# Altium schematic sheet 00-Chopper-AB.SchDoc
size C; DocumentNumber: 1; SheetNumber: 1; SheetTotal: 4
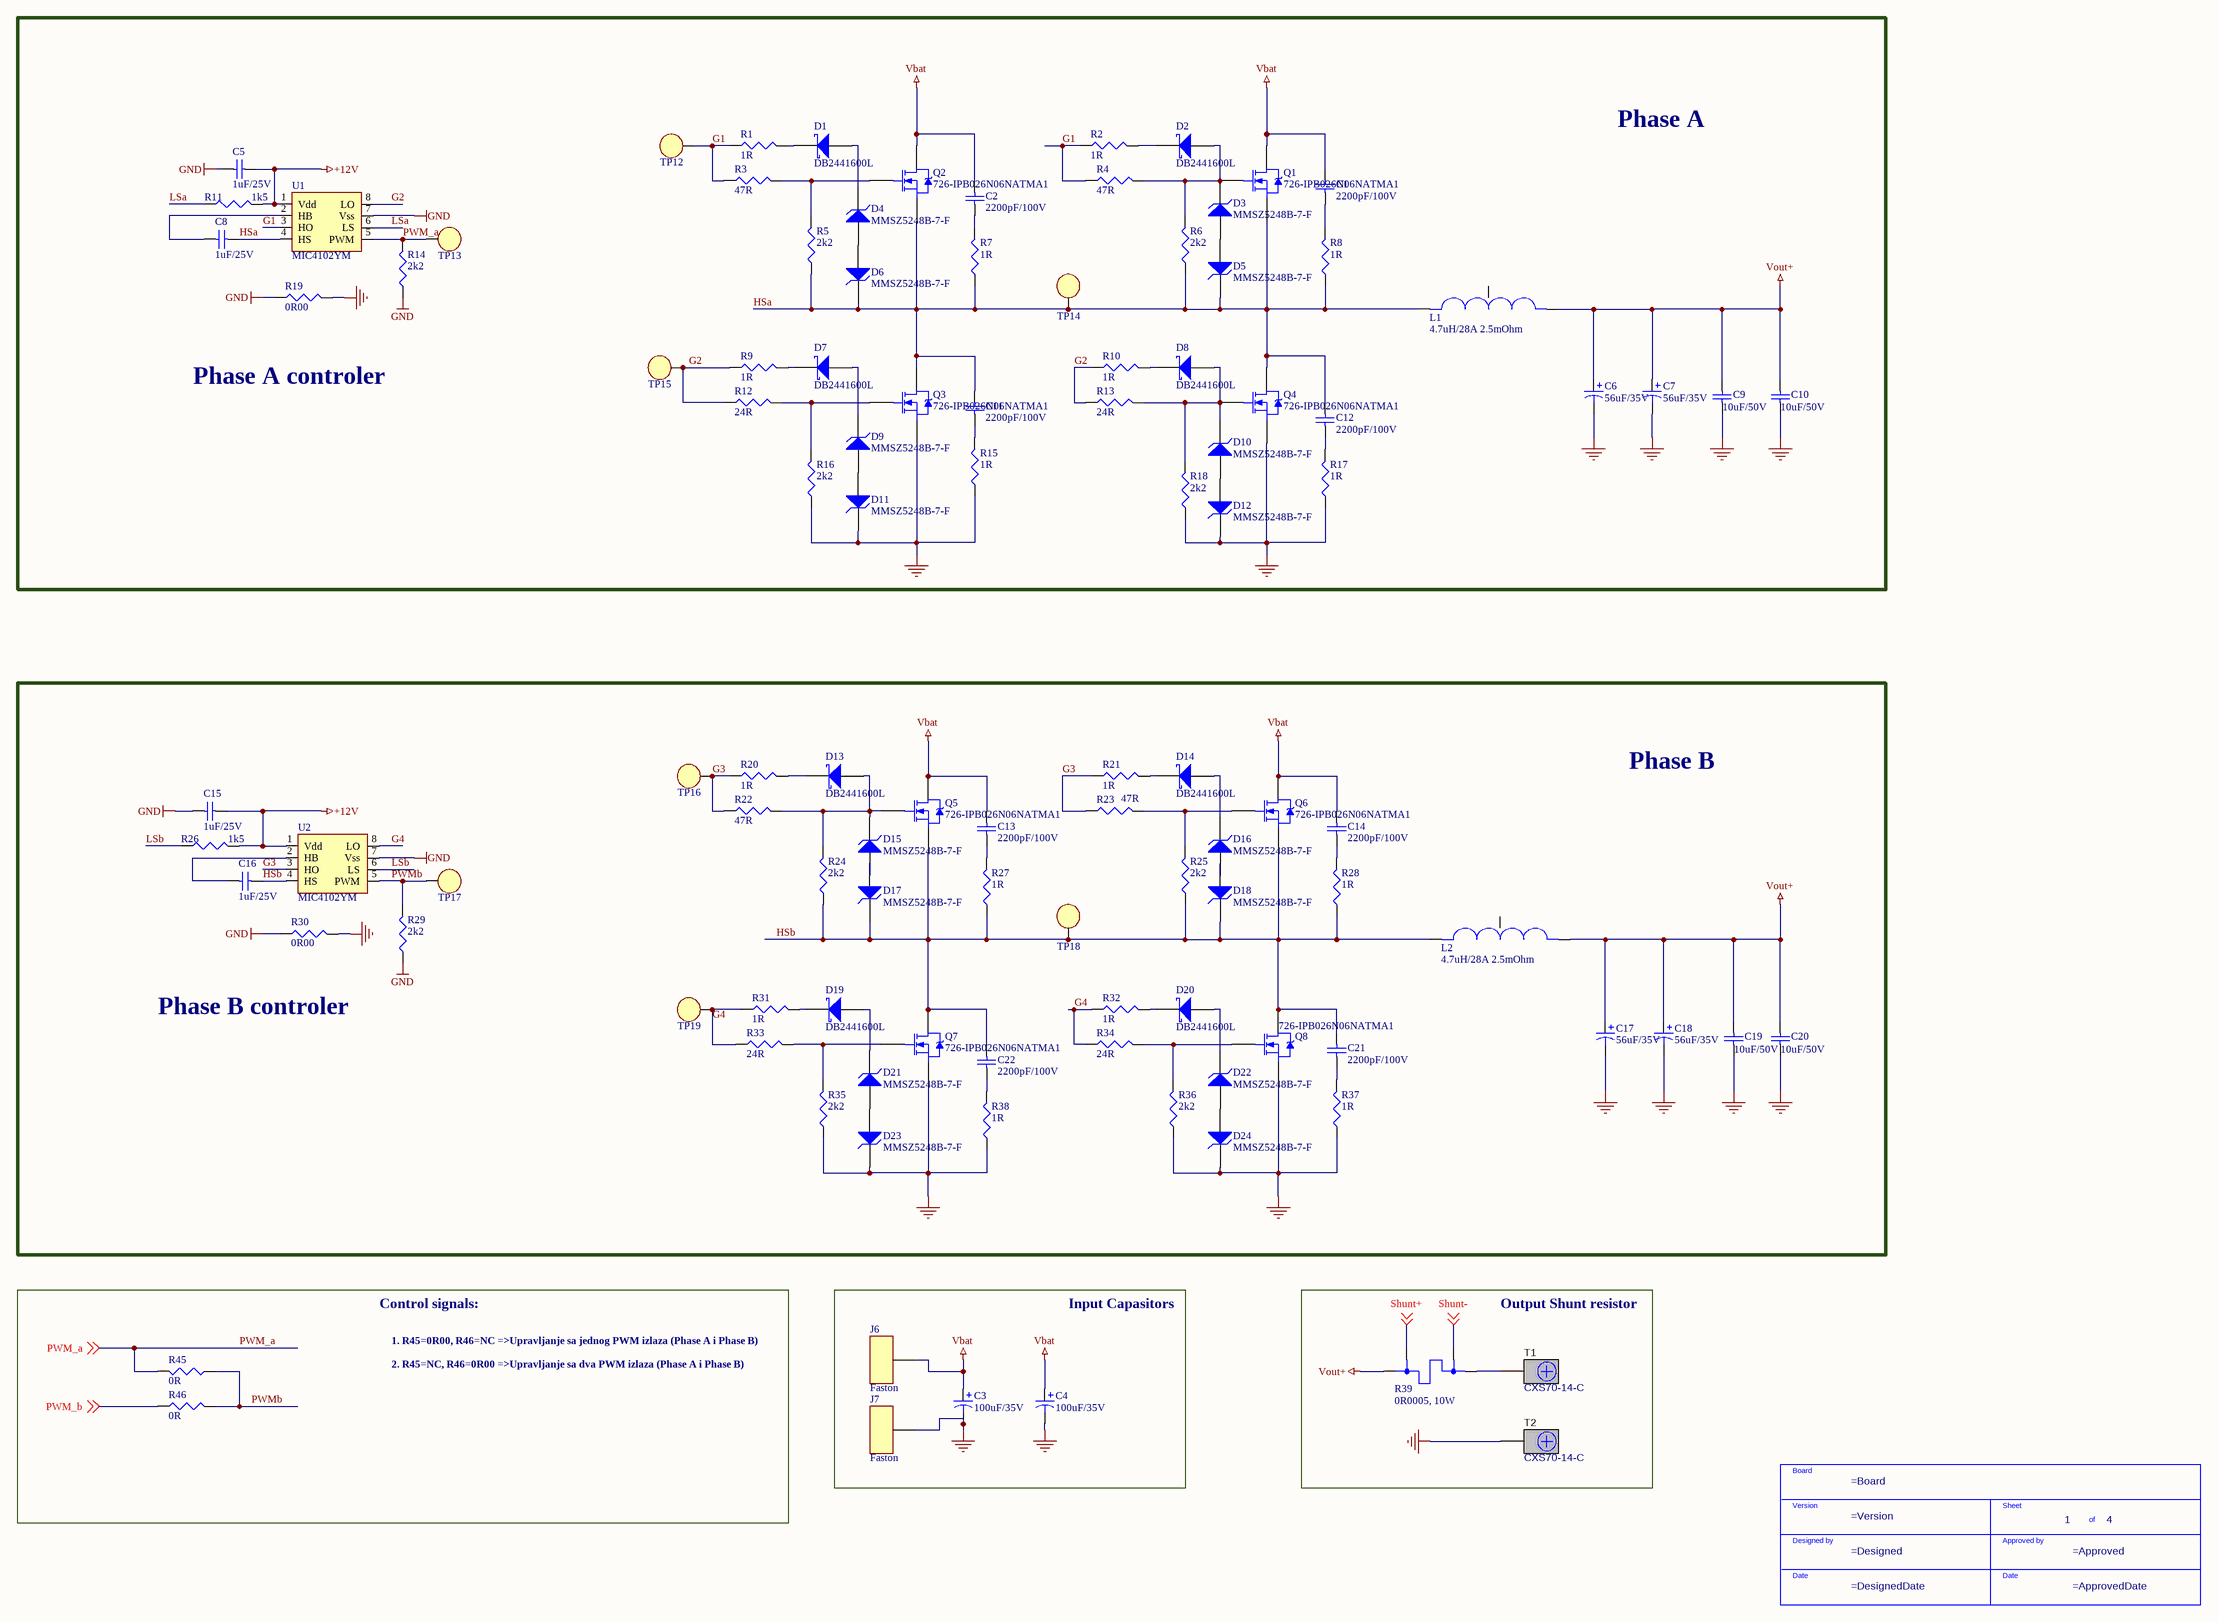
[diagram p0: 00-Chopper-AB.SchDoc]

## Parts
C1  2200pF/100V  [DiscCapacitorSnuber]
C2  2200pF/100V  [DiscCapacitorSnuber]
C3  100uF/35V  [CAPAE8884X86M]
C4  100uF/35V  [CAPAE8884X86M]
C5  1uF/25V  [CAPC2013X14N]
C6  56uF/35V  [CAPAE10184X100M]
C7  56uF/35V  [CAPAE10184X100M]
C8  1uF/25V  [CAPC2013X14N]
C9  10uF/50V  [CAPC3426X27N]
C10  10uF/50V  [CAPC3426X27N]
C11  2200pF/100V  [DiscCapacitorSnuber]
C12  2200pF/100V  [DiscCapacitorSnuber]
C13  2200pF/100V  [DiscCapacitorSnuber]
C14  2200pF/100V  [DiscCapacitorSnuber]
C15  1uF/25V  [CAPC2013X14N]
C16  1uF/25V  [CAPC2013X14N]
C17  56uF/35V  [CAPAE10184X100M]
C18  56uF/35V  [CAPAE10184X100M]
C19  10uF/50V  [CAPC3426X27N]
C20  10uF/50V  [CAPC3426X27N]
C21  2200pF/100V  [DiscCapacitorSnuber]
C22  2200pF/100V  [DiscCapacitorSnuber]
D1  DB2441600L  [DIOM4824X10N]
D2  DB2441600L  [DIOM4824X10N]
D3  MMSZ5248B-7-F  [DIOM3715X14N]
D4  MMSZ5248B-7-F  [DIOM3715X14N]
D5  MMSZ5248B-7-F  [DIOM3715X14N]
D6  MMSZ5248B-7-F  [DIOM3715X14N]
D7  DB2441600L  [DIOM4824X10N]
D8  DB2441600L  [DIOM4824X10N]
D9  MMSZ5248B-7-F  [DIOM3715X14N]
D10  MMSZ5248B-7-F  [DIOM3715X14N]
D11  MMSZ5248B-7-F  [DIOM3715X14N]
D12  MMSZ5248B-7-F  [DIOM3715X14N]
D13  DB2441600L  [DIOM4824X10N]
D14  DB2441600L  [DIOM4824X10N]
D15  MMSZ5248B-7-F  [DIOM3715X14N]
D16  MMSZ5248B-7-F  [DIOM3715X14N]
D17  MMSZ5248B-7-F  [DIOM3715X14N]
D18  MMSZ5248B-7-F  [DIOM3715X14N]
D19  DB2441600L  [DIOM4824X10N]
D20  DB2441600L  [DIOM4824X10N]
D21  MMSZ5248B-7-F  [DIOM3715X14N]
D22  MMSZ5248B-7-F  [DIOM3715X14N]
D23  MMSZ5248B-7-F  [DIOM3715X14N]
D24  MMSZ5248B-7-F  [DIOM3715X14N]
J6  Faston  [KONEKTOR-I-FASTON]
J7  Faston  [KONEKTOR-I-FASTON]
L1  4.7uH/28A 2.5mOhm  [BournsInductor_4.7uH]
L2  4.7uH/28A 2.5mOhm  [BournsInductor_4.7uH]
Q1  726-IPB026N06NATMA1  [DPAK508P1524X457-3N - duplicate]
Q2  726-IPB026N06NATMA1  [DPAK508P1524X457-3N - duplicate]
Q3  726-IPB026N06NATMA1  [DPAK508P1524X457-3N - duplicate]
Q4  726-IPB026N06NATMA1  [DPAK508P1524X457-3N - duplicate]
Q5  726-IPB026N06NATMA1  [DPAK508P1524X457-3N - duplicate]
Q6  726-IPB026N06NATMA1  [DPAK508P1524X457-3N - duplicate]
Q7  726-IPB026N06NATMA1  [DPAK508P1524X457-3N - duplicate]
Q8  726-IPB026N06NATMA1  [DPAK508P1524X457-3N - duplicate]
R1  1R  [RESC2914X05N]
R2  1R  [RESC2914X05N]
R3  47R  [RESC2914X05N]
R4  47R  [RESC2914X05N]
R5  2k2  [RESC2914X05N]
R6  2k2  [RESC2914X05N]
R7  1R  [RESC6432X08N]
R8  1R  [RESC6432X08N]
R9  1R  [RESC2914X05N]
R10  1R  [RESC2914X05N]
R11  1k5  [RESC2914X05N]
R12  24R  [RESC2914X05N]
R13  24R  [RESC2914X05N]
R14  2k2  [RESC2914X05N]
R15  1R  [RESC6432X08N]
R16  2k2  [RESC2914X05N]
R17  1R  [RESC6432X08N]
R18  2k2  [RESC2914X05N]
R19  0R00  [RESC2914X05N]
R20  1R  [RESC2914X05N]
R21  1R  [RESC2914X05N]
R22  47R  [RESC2914X05N]
R23  47R  [RESC2914X05N]
R24  2k2  [RESC2914X05N]
R25  2k2  [RESC2914X05N]
R26  1k5  [RESC2914X05N]
R27  1R  [RESC6432X08N]
R28  1R  [RESC6432X08N]
R29  2k2  [RESC2914X05N]
R30  0R00  [RESC2914X05N]
R31  1R  [RESC2914X05N]
R32  1R  [RESC2914X05N]
R33  24R  [RESC2914X05N]
R34  24R  [RESC2914X05N]
R35  2k2  [RESC2914X05N]
R36  2k2  [RESC2914X05N]
R37  1R  [RESC6432X08N]
R38  1R  [RESC6432X08N]
R39  0R0005, 10W  [PBV]
R45  0R  [R0805]
R46  0R  [R0805]
STB  -  (value not drawn)  (graphical)
T1  CXS70-14-C  [Panduit_CXS70-14-C]
T2  CXS70-14-C  [Panduit_CXS70-14-C]
TP12  -  [TESTPOINT_0.8X1.5]  (value not drawn)  (no BOM)
TP13  -  [TESTPOINT_0.8X1.5]  (value not drawn)  (no BOM)
TP14  -  [TESTPOINT_0.8X1.5]  (value not drawn)  (no BOM)
TP15  -  [TESTPOINT_0.8X1.5]  (value not drawn)  (no BOM)
TP16  -  [TESTPOINT_0.8X1.5]  (value not drawn)  (no BOM)
TP17  -  [TESTPOINT_0.8X1.5]  (value not drawn)  (no BOM)
TP18  -  [TESTPOINT_0.8X1.5]  (value not drawn)  (no BOM)
TP19  -  [TESTPOINT_0.8X1.5]  (value not drawn)  (no BOM)
U1  MIC4102YM  [SOIC127P610X173-8N]
U2  MIC4102YM  [SOIC127P610X173-8N]

## Blocks framed on the sheet
Control signals:: R45 R46
Input Capasitors: C3 C4 J6 J7
Output Shunt resistor: R39 T1 T2

## Nets
+12V: C5.1 C15.2 R11.2 R26.2 U1.1(Vdd) U2.1(Vdd)
GND: C5.2 C15.1 R14.1 R19.1 R29.1 R30.1 U1.7(Vss) U2.7(Vss)
P_GND: C3.2 C4.2 C6.2 C7.2 C9.1 C10.1 C17.2 C18.2 C19.1 C20.1 D11.2(K) D12.2(K) D23.2(K) D24.2(K) J7.1 Q3.3 Q4.3 Q7.3 Q8.3 R15.1 R16.1 R17.1 R18.1 R19.2 R30.2 R35.1 R36.1 R37.1 R38.1 T2.1
Vbat: C1.2 C2.2 C3.1 C4.1 C13.2 C14.2 J6.1 Q1.2 Q2.2 Q5.2 Q6.2
Vout+: C6.1 C7.1 C9.2 C10.2 C17.1 C18.1 C19.2 C20.2 L1.2 L2.2 R39.I1
G1: R1.1 R2.1 R3.1 R4.1 TP12.1 U1.3(HO)
G2: R9.1 R10.1 R12.1 R13.1 TP15.1 U1.8(LO)
G3: R20.1 R21.1 R22.1 R23.1 TP16.1 U2.3(HO)
G4: R31.1 R32.1 R33.1 R34.1 TP19.1 U2.8(LO)
HSa: C8.1 C11.2 C12.2 D5.2(K) D6.2(K) L1.1 Q1.3 Q2.3 Q3.2 Q4.2 R5.1 R6.1 R7.1 R8.1 TP14.1 U1.4(HS)
HSb: C16.1 C21.2 C22.2 D17.2(K) D18.2(K) L2.1 Q5.3 Q6.3 Q7.2 Q8.2 R24.1 R25.1 R27.1 R28.1 TP18.1 U2.4(HS)
LSa: R11.1 U1.6(LS)
LSb: R26.1 U2.6(LS)
PWM_a: R14.2 R45.2 TP13.1 U1.5(PWM) ; off-sheet PWM_a
PWM_b: R46.1 ; off-sheet PWM_b
PWMb: R29.2 R45.1 R46.2 TP17.1 U2.5(PWM)
Shunt+: R39.U1 ; off-sheet Shunt+
Shunt-: R39.U2 ; off-sheet Shunt-
NetC1_1: C1.1 R8.2
NetC2_1: C2.1 R7.2
NetC8_2: C8.2 U1.2(HB)
NetC11_1: C11.1 R15.2
NetC12_1: C12.1 R17.2
NetC13_1: C13.1 R27.2
NetC14_1: C14.1 R28.2
NetC16_2: C16.2 U2.2(HB)
NetC21_1: C21.1 R37.2
NetC22_1: C22.1 R38.2
NetD1_1: D1.1(A) D4.2(K)
NetD1_2: D1.2(K) R1.2
NetD2_1: D2.1(A) D3.2(K) Q1.1 R4.2 R6.2
NetD2_2: D2.2(K) R2.2
NetD3_1: D3.1(A) D5.1(A)
NetD4_1: D4.1(A) D6.1(A)
NetD7_1: D7.1(A) D9.2(K)
NetD7_2: D7.2(K) R9.2
NetD8_1: D8.1(A) D10.2(K) Q4.1 R13.2 R18.2
NetD8_2: D8.2(K) R10.2
NetD9_1: D9.1(A) D11.1(A)
NetD10_1: D10.1(A) D12.1(A)
NetD13_1: D13.1(A) D15.2(K) Q5.1 R22.2 R24.2
NetD13_2: D13.2(K) R20.2
NetD14_1: D14.1(A) D16.2(K)
NetD14_2: D14.2(K) R21.2
NetD15_1: D15.1(A) D17.1(A)
NetD16_1: D16.1(A) D18.1(A)
NetD19_1: D19.1(A) D21.2(K)
NetD19_2: D19.2(K) R31.2
NetD20_1: D20.1(A) D22.2(K)
NetD20_2: D20.2(K) R32.2
NetD21_1: D21.1(A) D23.1(A)
NetD22_1: D22.1(A) D24.1(A)
NetQ2_1: Q2.1 R3.2 R5.2
NetQ3_1: Q3.1 R12.2 R16.2
NetQ6_1: Q6.1 R23.2 R25.2
NetQ7_1: Q7.1 R33.2 R35.2
NetQ8_1: Q8.1 R34.2 R36.2
NetR39_I2: R39.I2 T1.1

Not connected (* = marked no-connect by the designer): L1 3; L2 3

## Notes on the sheet
- Phase A
- Phase A controler
- Phase B
- Phase B controler
- 1. R45=0R00, R46=NC =>Upravljanje sa jednog PWM izlaza (Phase A i Phase B)
- 2. R45=NC, R46=0R00 =>Upravljanje sa dva PWM izlaza (Phase A i Phase B)
- (in symbol Schematic Title Block) Board; Version; Sheet; of; Designed by; Approved by; Date

## Library data of the parts
C1 C2 C11-C14 C21 C22 = D222K25Y5PH63J5R: D222K25Y5PH63J5R -  Ceramic Disc Capacitor, 2200 pF, 100 V, D Series, ± 10%, Y5P, 5 mm; Manufacturer: Vishay; Max Rated Voltage: 100V; Type: THT; Manufacturer Part Number: D222K25Y5PH63J5R; Package: *; Category: Capasitor; Dielectric Characteristic: Y5P; Supplier1: Farnell; Supplier part number: 1827838; Tolerance: 10%; ComponentLink1Description: Datasheet; ComponentLink1URL: http://www.farnell.com/datasheets/2046069.pdf?_ga=2.161221557.908146518.1581324380-437978810.1505463394
C3 C4 = RHS1V101MCN1GS: NICHICON         RHS1V101MCN1GS             ALUMINUM ELECTROLYTIC CAPACITOR, 100UF, 20%, 35V, SMD; Ripple Current: 3A; ESR (Equivalent Series Resistance): 25mR; Leakage Current: 700uA; Life (Hours): 2000Hour; Dissipation Factor: 0.12%; Supplier 1: Mouser; Manufacturer: Nichicon; Manufacturer Part Number: RHS1V101MCN1GS; Stock 1: 2294; Pricing 1: 1=2.74, 10=2.25, 25=2.19, 100=1.75, 250=1.66, 500=1.19 (USD); Mount: Surface Mount; Case/Package: SMD/SMT; Min Operating Temperature: -55°C; Max Operating Temperature: 105°C; Packaging: Tape and Reel; Capacitance: 100uF; Tolerance: 20%; Voltage Rating: 35V; Package Quantity: 1; Ripple Current (AC): 3A; Voltage Rating (DC): 35V; Termination: SMD/SMT; Diameter: 8mm; Length: 8.7mm; Height: 8.3mm; Width: 8.3mm; Height - Seated (Max): 0.354inch; REACH SVHC: No SVHC; ComponentLink1URL: https://eu.mouser.com/datasheet/2/293/e-rhs_rha-1513422.pdf; ComponentLink1Description: Datasheet; Supplier Part Number 1: 647-RHS1V101MCN1GS; Category: Capacitors
C5 C8 C15 C16 = CL21B105KAFNNNG: 1µF ±10% 25V Ceramic Capacitor X7R 0805 (2012 Metric); Manufacturer: Samsung Electro-Mechanics; Type: SMD; Manufacturer Part Number: CL21B105KAFNNNG; Package: CAPC2012X88N; Category: Capasitor; Max Rated Voltage: 25V; Temperature coefficient: X7R; Supplier1: Digi-key; Supplier part number: 1276-6469-2-ND; ComponentLink1Description: Datasheet; ComponentLink1URL: http://www.samsungsem.com/kr/support/product-search/mlcc/__icsFiles/afieldfile/2019/06/18/CL21B105KAFNNNG-19.pdf; Tolerance: 10%
C6 C7 C17 C18 = PCV1V560MCL1GS: 56µF 35V Aluminum Polymer Capacitor Radial, Can - SMD 31mOhm 3000 Hrs @ 105°C; Manufacturer: Nichicon; Ripple Current: 1.9A; ESR (Equivalent Series Resistance): 31mR; Capacitance: 56uF; Tolerance: 20%; Leakage Current: 700uA; Life (Hours): 2000Hour; Dissipation Factor: 0.12%; Supplier 1: Mouser; Manufacturer Part Number: PCV1V560MCL1GS; Stock 1: 2294; Pricing 1: 1=2.74, 10=2.25, 25=2.19, 100=1.75, 250=1.66, 500=1.19 (USD); Mount: Surface Mount; Case/Package: SMD/SMT; Min Operating Temperature: -55°C; Max Operating Temperature: 105°C; Packaging: Tape and Reel; Voltage Rating: 35V; Package Quantity: 1; Ripple Current (AC): 1.9A; Voltage Rating (DC): 35V; Termination: SMD/SMT; Diameter: 8mm; Length: 8.3mm; Height: 8.3mm; Width: 8.3mm; Height - Seated (Max): 0.394inch; REACH SVHC: No SVHC; Supplier Part Number 1: 647-RHS1V101MCN1GS; Category: Capacitors; ComponentLink1Description: Datasheet; ComponentLink1URL: https://eu.mouser.com/datasheet/2/293/e-pcv-884151.pdf
C9 C10 C19 C20 = UMK325C7106MM-T: 10µF ±20% 50V Ceramic Capacitor X7S 1210 (3225 Metric); Manufacturer: Taiyo Yuden; Type: SMD; Manufacturer Part Number: UMK325C7106MM-T; Package: CAPC3225X125N; Category: Capasitor; Max Rated Voltage: 50 V; Dielectric Characteristic: X7S; Supplier1: Digikey; Supplier part number: 587-1818-2-ND; Tolerance: 20%; ComponentLink1Description: Datasheet; ComponentLink1URL: https://media.digikey.com/pdf/Data%20Sheets/Taiyo%20Yuden%20PDFs%20URL%20links/UMK325C7106MM-T.pdf
D1 D2 D7 D8 D13 D14 D19 D20 = DB2441600L: Diodes - General Purpose, Power, Switching Schottky Barrier Diode; Manufacturer: Panasonic; Peak Reverse Voltage: 40 V; Max Surge Current: 50 A; Forward Current: 3 A; Type: SMD; Manufacturer Part Number: DB2441600L; Package: *; Category: Shottky; Supplier1: Mouser; Supplier part number: 667-DB2441600L; ComponentLink1Description: Datasheet; ComponentLink1URL: https://eu.mouser.com/datasheet/2/315/DB2441600L_E-1141476.pdf
D3-D6 D9-D12 D15-D18 D21-D24 = MMSZ5248B-7-F: Diodes Inc, 18V Zener Diode 5% 500 mW SMT 2-Pin SOD-123; Manufacturer: Diode Zetex; Maximum Power Dissipation: 500 mW; Test Current: 7 mA; Type: SMD; Manufacturer Part Number: MMSZ5248B-7-F; Package: SOD3716X135N; Category: Zener diode; Nominal Zener Voltage: 18 V; Supplier1: RS Components; Supplier part number: 121-9610; ComponentLink1Description: Datasheet; ComponentLink1URL: https://eu.mouser.com/datasheet/2/115/ds18010-38133.pdf
J6 J7 = Faston Konektor: KONEKTOR FASTON OBICNI; Type: THT
L1 L2 = PQ2617BHA-4R7K: FIXED IND 4.7UH 28A 2.5MOHM SMD; Manufacturer: Bourns; Core Material: Ferrite; Tolerance: 10%; Saturation Current: 61.2A; Shielding: Shielded; DC Resistance (DCR): 2.5mR; Self Resonant Frequency: 30MHz; Test Frequency: 100kHz; Supplier 1: Mouser; Supplier Part Number 1: 652-PQ2617BHA-4R7K; Manufacturer Part Number: PQ2617BHA-4R7K; Stock 1: 790; Pricing 1: 1=3.71, 5=3.56, 10=3.41, 25=3.1, 50=2.6, 100=2.23 (USD); Mount: Surface Mount; Case/Package: Nonstandard; Min Operating Temperature: -40°C; Max Operating Temperature: 155°C; Composition: Wirewound; Packaging: Tray; Inductance: 4.7uH; Current Rating: 28A; Ratings: AEC-Q200; ComponentLink1URL: https://www.bourns.com/docs/Product-Datasheets/PQ2617.pdf?src-supplier=Digi-Key; ComponentLink1Description: https://www.bourns.com/docs/Product-Datasheets/PQ2617.pdf?src-supplier=Digi-Key; Category: Fixed Inductors
Q1-Q8 = IPB026N06NATMA1: MOSFET N-Ch 60V 100A D2PAK-2; Manufacturer: Infineon Technologies; Rise Time: 15ns; Rds On Max: 2.6mR; Input Capacitance: 5.125nF; Drain to Source Resistance: 2.3mR; Power Dissipation: 175W; Number of Elements: 1; Turn-On Delay Time: 17ns; Turn-Off Delay Time: 30ns; Fall Time: 8ns; Gate to Source Voltage (Vgs): 20V; Manufacturer Part Number: IPB026N06NATMA1; Mount: Surface Mount; Case/Package: D2PAK; Number of Pins: 3; Min Operating Temperature: -55°C; Max Operating Temperature: 175°C; Packaging: Reel; Package Quantity: 1000; Continuous Drain Current (ID): 100A; Drain to Source Breakdown Voltage: 60V; Drain to Source Voltage (Vdss): 60V; Max Power Dissipation: 175W; Radiation Hardening: No; Category: MOSFET; ComponentLink1Description: Datasheet; ComponentLink1URL: https://www.mouser.co.uk/datasheet/2/196/Infineon-IPB026N06N-DS-v02_02-en-1227367.pdf
R1 R2 R9 R10 R20 R21 R31 R32 = CRCW08051R00FKEA: Res Thick Film 0805 1 Ohm 1% 1/8W ±100ppm/°C Molded SMD SMD Paper T/R; Manufacturer: Vishay; Power rating: 0.125W; Manufacturer Part Number: CRCW08051R00FKEA; Package: RESC1608X50N; Category: Resistor; Resistance: 1R; Tolerance: 1%; Voltage rating: *; Type: SMD; Supplier1: Avnet Abacus; Supplier part number: CRCW08051R00FKEA; ComponentLink1Description: Datasheet; ComponentLink1URL: http://www.vishay.com/docs/20035/dcrcwe3.pdf
R3 R4 R22 R23 = RC0805FR-0747RL: RC Series 0805 0.125 W 47 Ohm ±1% ±100 ppm/°C SMT Thick Film Chip Resistor; Manufacturer: Yageo; Power rating: 0.125W; Resistance: 24R; Manufacturer Part Number: RC0805FR-0747RL; Package: RESC1608X50N; Category: Resistor; Tolerance: 1%; Number of pins: 2; Type: SMD; Supplier1: Future electronics; Supplier part number: RC0805FR-0747RL; ComponentLink1Description: Datasheet; ComponentLink1URL: https://www.yageo.com/upload/media/product/productsearch/datasheet/rchip/PYu-RC_Group_51_RoHS_L_10.pdf
R5 R6 R14 R16 R18 R24 R25 R29 R35 R36 = RC0805FR-072K2L: RC Series 0805 0.125 W 2.2 kOhm ±1% ±100 ppm/°C SMT Thick Film Chip Resistor; Manufacturer: Yageo; Power rating: 0.125W; Manufacturer Part Number: RC0805FR-072K2L; Package: RESC1608X50N; Category: Resistor; Resistance: 2k2; Tolerance: 1%; Number of pins: 2; Type: SMD; Supplier1: Future electronics; Supplier part number: RC0805FR-072K2L; ComponentLink1Description: Datasheet; ComponentLink1URL: http://www.yageo.ru/pdf/RC0805.pdf
R7 R8 R15 R17 R27 R28 R37 R38 = CR2512-J/-1R0ELF: Thick Film Resistors - SMD CHIP RESISTOR; Manufacturer: Bourns; Power rating: 1W; Tolerance: 5%; Voltage rating: 200V; Manufacturer Part Number: CR2512-J/-1R0ELF; Package: RESC2012X60N; Category: Resistor; Resistance: 1R; Type: SMD; Supplier1: Mouser; Supplier part number: 652-CR2512-J/-1R0ELF; ComponentLink1Description: Datasheet; ComponentLink1URL: https://eu.mouser.com/datasheet/2/54/cr2010-777415.pdf
R11 R26 = CRCW08051K50FKEA: Res Thick Film 0805 1.5K Ohm 1% 1/8W ±100ppm/°C Molded SMD Paper T/R; Manufacturer: Vishay; Power rating: 0.125 W; Manufacturer Part Number: CRCW08051K50FKEA; Package: RESC2012X60N; Category: Resistor; Resistance: 1k5; Tolerance: 1%; Number of pins: 2; Type: SMD; Supplier1: Future electronics; Supplier part number: CRCW08051K50FKEA; ComponentLink1Description: Datasheet; ComponentLink1URL: http://www.vishay.com/docs/20035/dcrcwe3.pdf
R12 R13 R33 R34 = CRCW080524R0FKEA: Res Thick Film 0805 24 Ohm 1% 1/8W ±100ppm/°C Molded SMD Paper T/R; Manufacturer: Vishay; Power rating: 0.125W; Manufacturer Part Number: CRCW080524R0FKEA; Package: RESC1608X50N; Category: Resistor; Resistance: 24R; Tolerance: 1%; Number of pins: 2; Type: SMD; Supplier1: Avnet abacus; Supplier part number: CRCW080524R0FKEA; ComponentLink1Description: Datasheet; ComponentLink1URL: http://www.vishay.com/docs/20035/dcrcwe3.pdf
R19 R30 = RC0805FR-070RL: Res Thick Film 0805 0 Ohm Jumper Molded SMD Paper T/R; Manufacturer: Yageo; Power rating: 0.125 W; Tolerance: 1%; Manufacturer Part Number: RC0805FR-070RL; Package: RESC2012X60N; Category: Resistor; Resistance: 0R00; Number of pins: 2; Type: SMD; Supplier1: Avnet abacus; Supplier part number: RC0805FR-070RL; ComponentLink1Description: Datasheet; ComponentLink1URL: https://www.yageo.com/documents/recent/PYu-RC_Group_51_RoHS_L_2.pdf
R39 = Shent_THT: SHENT 0R0005 10W THT; Manufacturer: *; Manufacturer Part Number: *; Supplier 1: *; Supplier Part Number 1: *; Type: THT
R45 R46 = CRCW08050000Z0EA: RES 0R00 0805 0.125W; Manufacturer: Vishay Dale; Resistance (Ohms): 0.0; Tolerance: Jumper; Power (Watts): 0.125W, 1/8W; .PCBChecked: BP; Manufacturer Part Number: CRCW08050000Z0EA; RoHS: RoHS Compliant; Category: Resistors; Packaging: Cut Tape (CT); Part Status: Active; Composition: Thick Film; Features: Automotive AEC-Q200; Temperature Coefficient: -; Operating Temperature: -55°C ~ 155°C; Package: RESC2012X60N; Supplier Device Package: 0805; Size / Dimension: 0.079" L x 0.049" W (2.00mm x 1.25mm); Height - Seated (Max): 0.020" (0.50mm); Failure Rate: -; ComponentLink1URL: http://www.vishay.com/docs/20035/dcrcwe3.pdf; ComponentLink1Description: Datasheet; Supplier 1: Future Electronics; Supplier Part Number 1: CRCW08050000Z0EA; Type: SMD; .SCHChecked: BP
STB = Schematic Title Block: Schematic Title Block Template
T1 T2 = CXS70-14-C: Terminal 70A Lug; Manufacturer: Panduit; SymbolCreator: crossc; CompType: Screw Terminal; U/M: EA; SymbolVersion: 2009-10-14; Manufacturer Part Number: CXS70-14-C; PackageReference: LUG, 32.3x14.5x11.7; RoHS: Y; MountType: TH; ComponentLink1Description: Datasheet Link; ComponentLink1URL: http://www.panduit.com/heiler/PartDrawings/C-PCCXS70-14-C--ENG.pdf; Publisher: Texas Instruments; LatestRevisionDate: 2014-11-22; Supplier 1: Digi-Key; Supplier Part Number 1: CXS70-14-C-ND; Supplier 2: Mouser; Supplier Part Number 2: 644-CXS70-14-C
TP12-TP19 = Testpoint: Testpoint 0.8mm X 1.5mm; .PCBChecked: BP; .SCHChecked: BP
U1 U2 = MIC4102YM: Gate Drivers 100V HalfBridge MOSFET Driver with Anti-Shoot-through Circuitry; Manufacturer: Microchip; Max Output Current: 3A; Max Supply Voltage: 16V; Min Supply Voltage: 9V; Number of Outputs: 2; Rise Time: 10ns; Nominal Supply Current: 3mA; Channel Type: Synchronous; Fall Time: 6ns; Supplier 1: RSComponents; Manufacturer Part Number: MIC4102YM; Stock 1: 0; Mount: Surface Mount; Case/Package: SOIC; Number of Pins: 8; Min Operating Temperature: -40°C; Max Operating Temperature: 125°C; Packaging: Rail/Tube; Output Current: 3A; Package Quantity: 95; Number of Drivers: 2; Termination: SMD/SMT; Length: 4.93mm; Height: 1.48mm; Width: 3.94mm; Lead Free: Lead Free; REACH SVHC: No SVHC; ComponentLink1URL: http://www.farnell.com/datasheets/83997.pdf?src-supplier=Farnell; ComponentLink1Description: http://www.farnell.com/datasheets/83997.pdf?src-supplier=Farnell; ComponentLink2URL: http://datasheet.iiic.cc/micrel/MIC4102YM.pdf?src-supplier=IIIC; ComponentLink2Description: http://datasheet.iiic.cc/micrel/MIC4102YM.pdf?src-supplier=IIIC; Supplier Part Number 1: 9101884; Category: MOSFET Drivers